# Altium schematic sheet white_noise.SchDoc
size A4
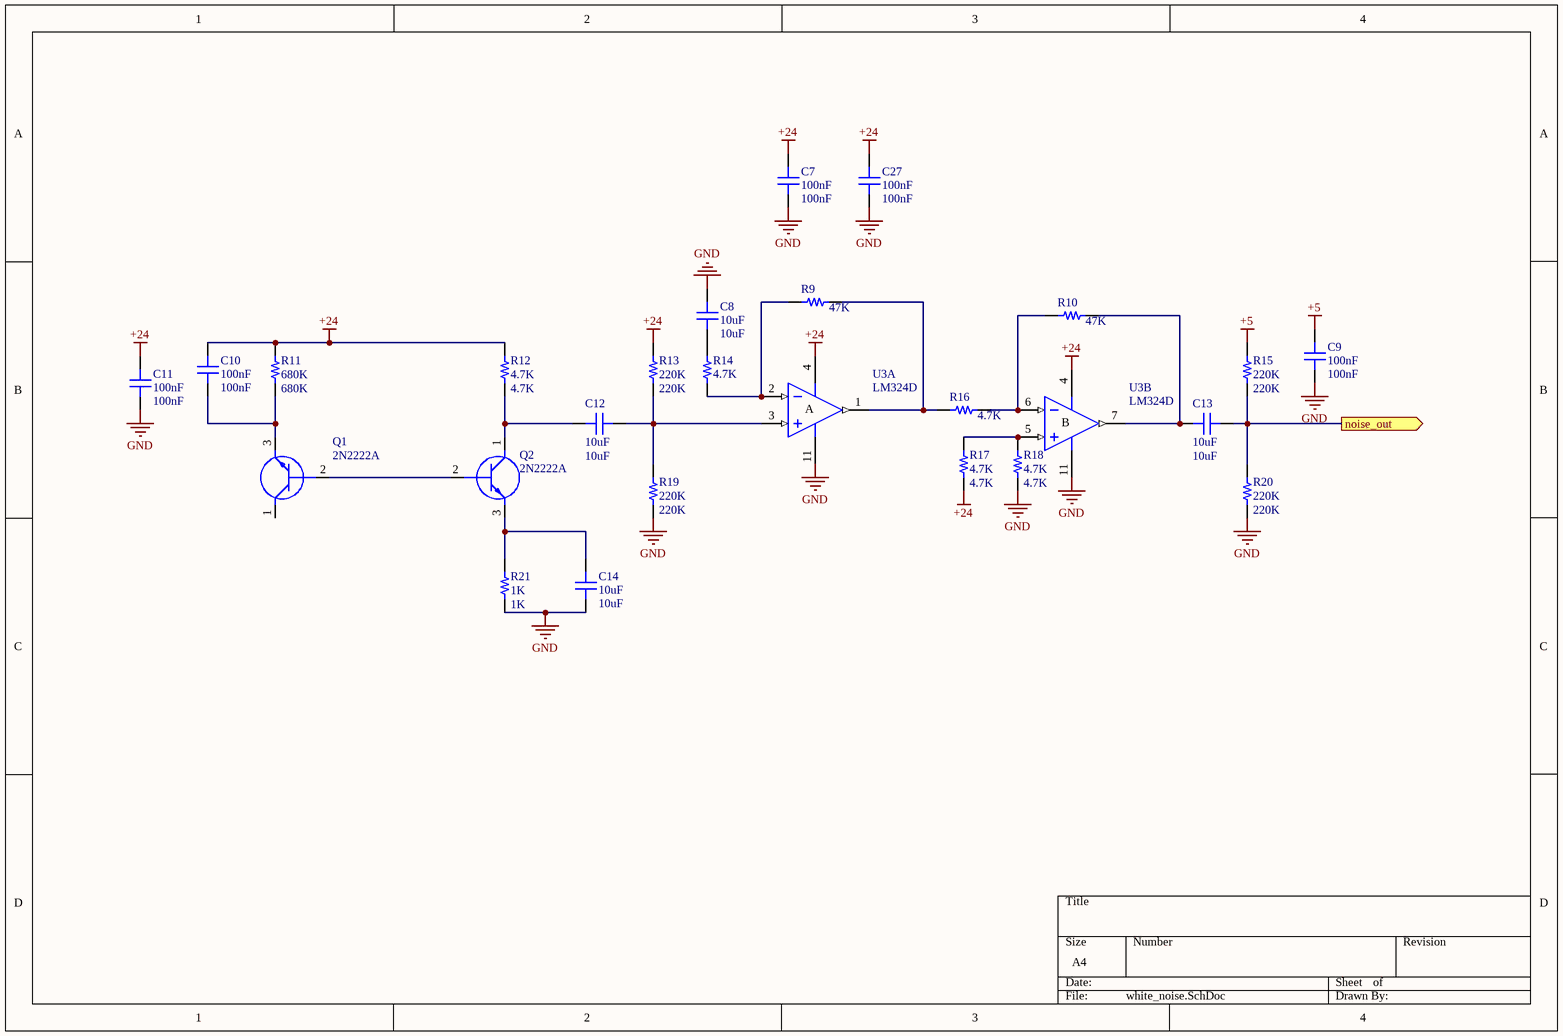
[diagram p0: white_noise.SchDoc]

## Parts
C7  100nF  [cap805]
C8  10uF  [cap805]
C9  100nF  [cap805]
C10  100nF  [cap805]
C11  100nF  [cap805]
C12  10uF  [cap805]
C13  10uF  [cap805]
C14  10uF  [cap805]
C27  100nF  [cap805]
Q1  2N2222A  [soT95p280x130-3n]
Q2  2N2222A  [soT95p280x130-3n]
R9  47K  [0603R]
R10  47K  [0603R]
R11  680K  [0603R]
R12  4.7K  [0603R]
R13  220K  [0603R]
R14  4.7K  [0603R]
R15  220K  [0603R]
R16  4.7K  [0603R]
R17  4.7K  [0603R]
R18  4.7K  [0603R]
R19  220K  [0603R]
R20  220K  [0603R]
R21  1K  [0603R]
U3  LM324D  [SO14_N]  (parts A,B of 4)

## Ports
noise_out (out)

## Nets
+5: C9.1 R15.2
+24: C7.1 C10.2 C11.1 C27.1 R11.2 R12.2 R13.2 R17.1 U3.4(V+)
GND: C7.2 C8.1 C9.2 C11.2 C14.1 C27.2 R18.1 R19.1 R20.1 R21.1 U3.11(V-)
noise_out: C13.1 R15.1 R20.2 ; port noise_out
NetC8_2: C8.2 R14.2
NetC10_1: C10.1 Q1.3(E) R11.1
NetC12_1: C12.1 R13.1 R19.2 U3.3(IN+)
NetC12_2: C12.2 Q2.1(C) R12.1
NetC13_2: C13.2 R10.1 U3.7(OUT)
NetC14_2: C14.2 Q2.3(E) R21.2
NetQ1_2: Q1.2(B) Q2.2(B)
NetR9_1: R9.1 R16.2 U3.1(OUT)
NetR9_2: R9.2 R14.1 U3.2(IN-)
NetR10_2: R10.2 R16.1 U3.6(IN-)
NetR17_2: R17.2 R18.2 U3.5(IN+)

Not connected (* = marked no-connect by the designer): Q1 1(C)

## Notes on the sheet
- (in symbol LM324D, part A) A
- (in symbol LM324D, part B) B

## Library data of the parts
C7-C14 C27 = Capacitor: CAP SMD 0805; Part Number: C0805X106K9RAC7800
  C7 C9-C11 C27: Value: 100nF
  C8 C12-C14: Value: 10uF
Q1 Q2 = 2N2222A: Transistor BJT NPN SMD; pin to pad: 1>3 2>1 3>2; Manufacturer_Name: Foshan Blue Rocket Elec; Datasheet Link: https://datasheet.lcsc.com/szlcsc/1901291437_Foshan-Blue-Rocket-Elec-2N2222A_C358533.pdf; Height: 4.7mm; Manufacturer_Part_Number: 2N2222A
R9-R21 = Resistor: RES SMD 0603; Part Number: RCS0805100KFKEA
  R9 R10: Value: 47K
  R11: Value: 680K
  R12 R14 R16-R18: Value: 4.7K
  R13 R15 R19 R20: Value: 220K
  R21: Value: 1K
U3 = LM324D: Low-Power Quad Operational Amplifier SMD; Published: 24-Aug-2001; LatestRevisionDate: 13-Apr-2006; LatestRevisionNote: IPC-7351 Footprint Added.; DatasheetVersion: Jun-1999; PackageVersion: Sep-1998; PackageReference: SO14; Publisher: Altium Limited; PackageDescription: 14-Pin Small Outline Integrated Circuit 1.27 mm Pitch; Code_IPC: SOIC127P600-14; ComponentLink1Description: Manufacturer Link; ComponentLink1URL: http://www.st.com/; ComponentLink2Description: Datasheet; ComponentLink2URL: http://www.st.com/stonline/products/literature/ds/2156/lm324.pdf